# Altium schematic sheet fillcap_power.SchDoc: Power
size A3; DrawnBy: daniw / ninux; Organization: HSLU T&A; Address1: Abteilung Elektrotechnik; Address2: Technikumsstrasse 21; Address3: CH-6048 Horw; SheetNumber: 9; SheetTotal: 9; Projektname: fillcap
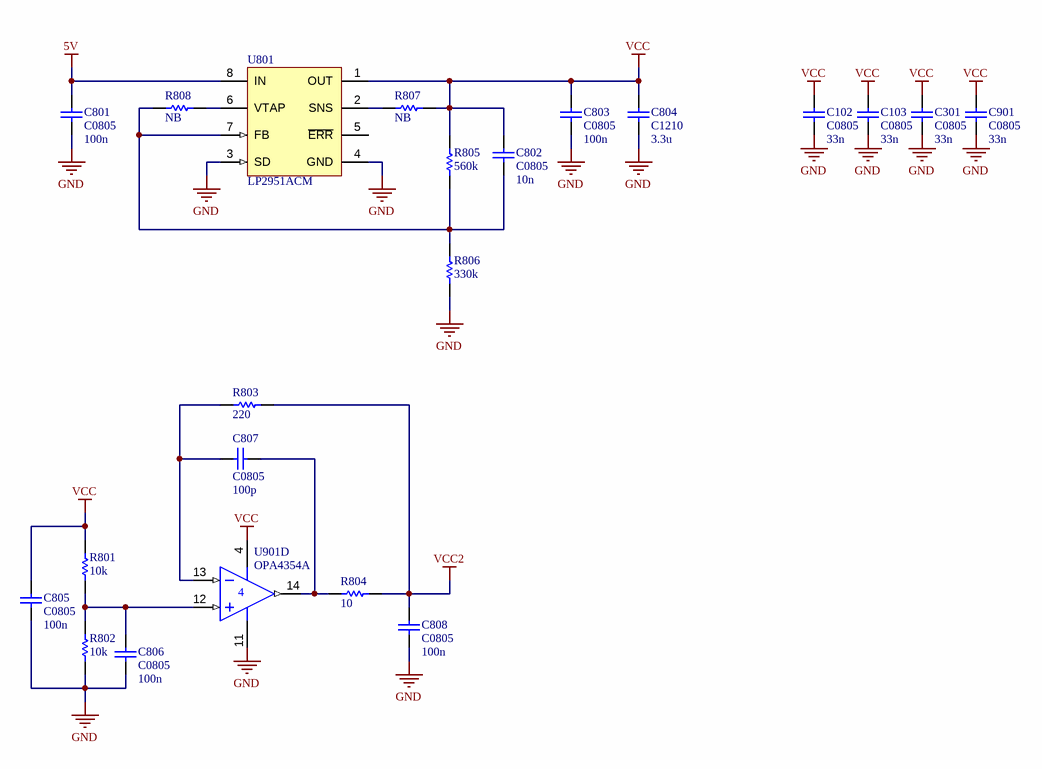
[diagram p0: fillcap_power.SchDoc]

## Parts
C102  C0805  value 33n  [0805]
C103  C0805  value 33n  [0805]
C301  C0805  value 33n  [0805]
C801  C0805  value 100n  [0805]
C802  C0805  value 10n  [0805]
C803  C0805  value 100n  [0805]
C804  C1210  value 3.3u  [1210]
C805  C0805  value 100n  [0805]
C806  C0805  value 100n  [0805]
C807  C0805  value 100p  [0805]
C808  C0805  value 100n  [0805]
C901  C0805  value 33n  [0805]
R801  10k  [ERA-0805]
R802  10k  [ERA-0805]
R803  220  [ERA-0805]
R804  10  [ERA-0805]
R805  560k  [ERA-0805]
R806  330k  [ERA-0805]
R807  NB  [ERA-0805]
R808  NB  [ERA-0805]
U801  LP2951ACM  [M08A_N]
U901  OPA4354A  [D014_N]  (part D of 4)

## Nets
5V: C801.2 U801.8(IN)
GND: C102.1 C103.1 C301.1 C801.1 C803.1 C804.1 C805.1 C806.1 C808.1 C901.1 R802.2 R806.2 U801.3(SD) U801.4(GND) U901.11(V-)
VCC: C102.2 C103.2 C301.2 C802.2 C803.2 C804.2 C805.2 C901.2 R801.1 R805.1 R807.2 U801.1(OUT) U901.4(V+)
VCC2: C808.2 R803.2 R804.2
NetC802_1: C802.1 R805.2 R806.1 R808.1 U801.7(FB)
NetC806_2: C806.2 R801.2 R802.1 U901.12(IN+)
NetC807_1: C807.1 R803.1 U901.13(IN-)
NetC807_2: C807.2 R804.1 U901.14(OUT)
NetR807_1: R807.1 U801.2(SNS)
NetR808_2: R808.2 U801.6(VTAP)

Not connected (* = marked no-connect by the designer): U801 5(~{ERR})

## Notes on the sheet
- Project:
- Drawn by:
- Size:
- Sheet
- A3
- Rev.:
- of
- Date:
- File:

## Library data of the parts
C102 C103 C301 C801-C803 C805-C808 C901 = C0805: Ceramic Chip Capacitor - Standard; Note: Footprint corresponds to dimensions for bulk cassette packaging. This case size has tightened tolerances.; Published: 17-Jul-2002; LatestRevisionDate: 19-Mar-2004; LatestRevisionNote: Silkscreen size reduced.; DatasheetDocument: Mar-2001; PackageDocument: Mar-2001; PackageReference: 0805; Publisher: Altium Limited; Code_JEITA: 0805; Code_IPC: 2012[0805]; ComponentLink1Description: Manufacturer Link; ComponentLink1URL: http://www.kemet.com/; ComponentLink2Description: Datasheet; ComponentLink2URL: http://www.kemet.com/kemet/web/homepage/kechome.nsf/vapubfilesname/F3102TA.pdf/$file/F3102TA.pdf
C804 = C1210: Ceramic Chip Capacitor - Standard; Published: 17-Jul-2002; LatestRevisionDate: 19-Mar-2004; LatestRevisionNote: Silkscreen size reduced.; DatasheetDocument: Mar-2001; PackageDocument: Mar-2001; PackageReference: 1210; Publisher: Altium Limited; Code_JEITA: 1210; Code_IPC: 3225 [1210]; ComponentLink1Description: Manufacturer Link; ComponentLink1URL: http://www.kemet.com/; ComponentLink2Description: Datasheet; ComponentLink2URL: http://www.kemet.com/kemet/web/homepage/kechome.nsf/vapubfilesname/F3102TA.pdf/$file/F3102TA.pdf
R801-R808 = ERAS: Metal Film Thermosensitive Chip Resistor, 0.56 Ohm to 10k Ohm Range, 5% Tolerance, 0805 Size, 0.1 W; Note: If flow soldering, adjust pad width of PCB Footprint to 0.7 - 0.8 times the width of the resistor.; Published: 17-Dec-2003; LatestRevisionDate: 19-Mar-2004; LatestRevisionNote: Silkscreen size reduced.; PackageDocument: Mar-2003; PackageReference: ERA-0805; Publisher: Altium Limited; Code_IPC: 2012 [0805]; ComponentLink1Description: Manufacturer Link; ComponentLink1URL: http://www.panasonic.com/industrial/components/resistive_products.htm; ComponentLink2Description: Datasheet; ComponentLink2URL: http://www.panasonic.com/industrial/components/pdf/AOF0000CE1.pdf
U801 = LP2951ACM: Series of Adjustable Micropower Voltage Regulators, 8-pin Narrow SOIC; Manufacturer: National Semiconductor; PackageTopMarking: NSZXTT*2951*ACMDD; PowerWise: N; CompType: LDO IC; Published: 4-Dec-2008; LatestRevisionDate: 07-Sep-2009; LatestRevisionNote: Bar removed from pin 3; DatasheetVersion: Jun-2009; PackageVersion: revM, May-2009; PackageReference: M08A; Publisher: Altium Limited; PackageDescription: SOIC Narrow, 4.9 x 3.9 x 1.45mm, 8 Lead, 1.27mm Pitch; Supplier 1: Farnell; Supplier Part Number 1: 9493425; PartNumber: LP2951ACM; RoHS: N; PinCount: 8; Code_JEDEC: MS-012-AA; Code_IPC: SOIC127P600-8; ComponentLink1Description: LP2951 Datasheet; ComponentLink1URL: http://www.national.com/ds/LP/LP2951.pdf; ComponentLink2Description: LP2951 Web Page; ComponentLink2URL: http://www.national.com/pf/LP/LP2951.html; ComponentLink3Description: M08A Package Page; ComponentLink3URL: http://www.national.com/packaging/folders/m08a.html
U901 = LM324AD: Quadruple Operational Amplifier; Published: 15-Apr-2002; LatestRevisionDate: 13-Apr-2006; LatestRevisionNote: IPC-7351 Footprint Added.; DatasheetVersion: Jan-1989; PackageVersion: Jan-1998; PackageReference: D014; Publisher: Altium Limited; PackageDescription: 14-Pin Small Outline Integrated Circuit 1.27 mm Pitch; Code_IPC: SOIC127P600-14; ComponentLink1Description: Manufacturer Link; ComponentLink1URL: http://www.ti.com/; ComponentLink2Description: Datasheet; ComponentLink2URL: http://www-s.ti.com/sc/ds/lm324.pdf